# Altium schematic sheet receiver.SchDoc
size OrCAD C; SheetNumber: 1; SheetTotal: 2
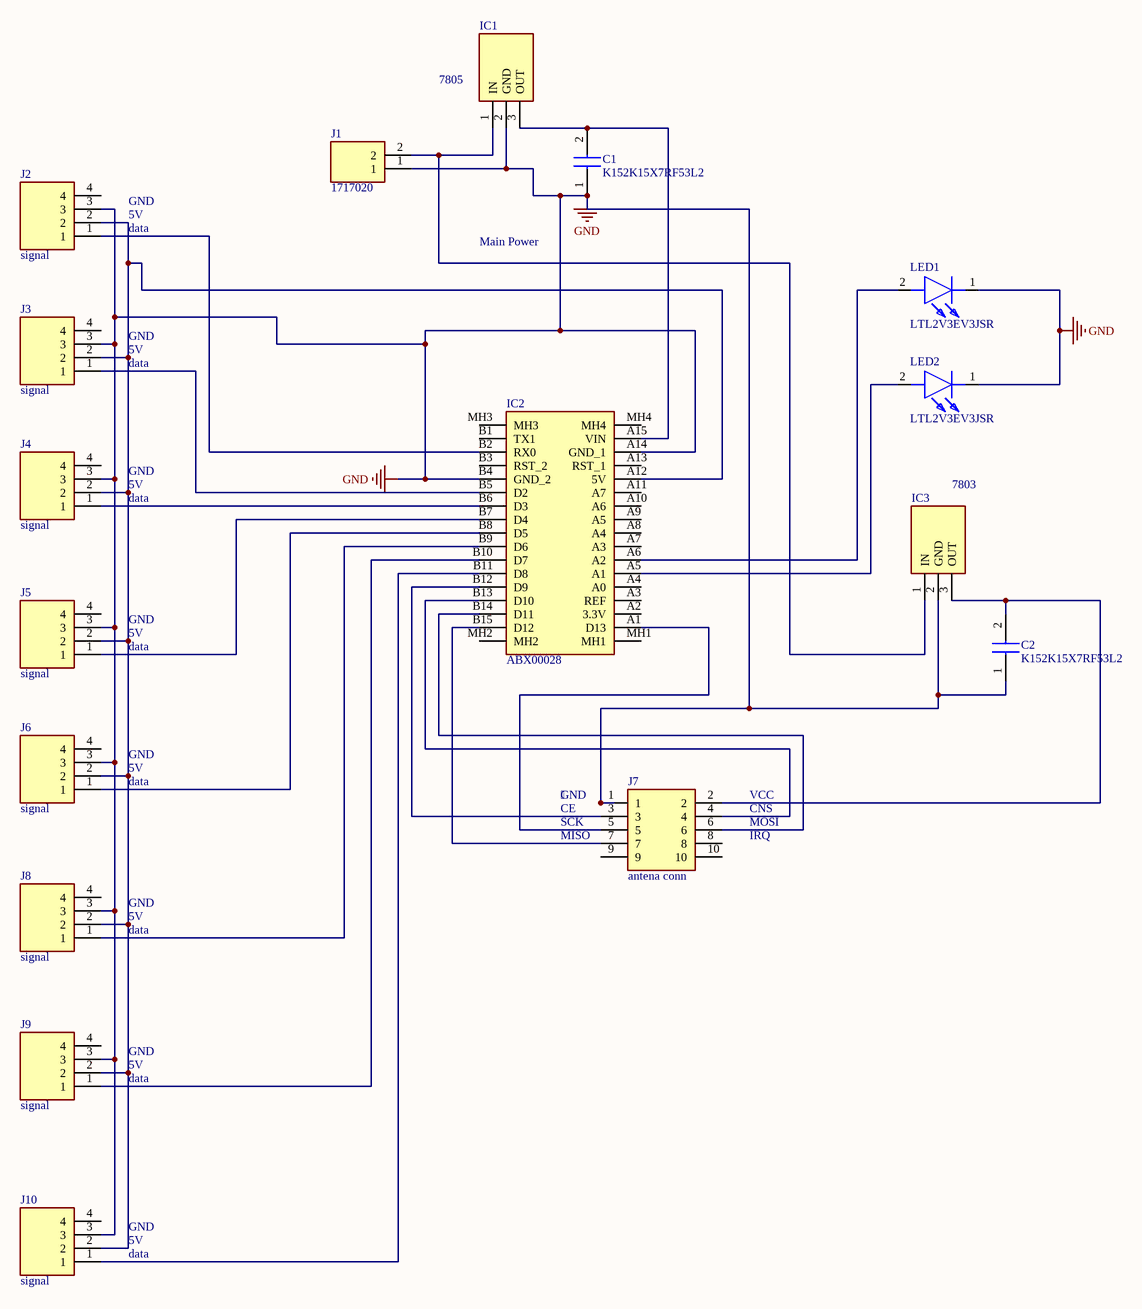
[diagram p0: receiver.SchDoc]

## Parts
C1  K152K15X7RF53L2  [K152K15X7RF53L2]
C2  K152K15X7RF53L2  [K152K15X7RF53L2]
IC1  7805  [TO254P470X1000X1610-3P]
IC2  ABX00028  [ABX00028]
IC3  7803  [TO254P470X1000X1610-3P]
J1  1717020  [1717020]
J2  signal  [HDRV4W87P0X254_1X4_991X236X1155P]
J3  signal  [HDRV4W87P0X254_1X4_991X236X1155P]
J4  signal  [HDRV4W87P0X254_1X4_991X236X1155P]
J5  signal  [HDRV4W87P0X254_1X4_991X236X1155P]
J6  signal  [HDRV4W87P0X254_1X4_991X236X1155P]
J7  antena conn  [HDRV10W87P254_2X5_1270X508X864P]
J8  signal  [HDRV4W87P0X254_1X4_991X236X1155P]
J9  signal  [HDRV4W87P0X254_1X4_991X236X1155P]
J10  signal  [HDRV4W87P0X254_1X4_991X236X1155P]
LED1  LTL2V3EV3JSR  [LTL2V3EV3JSR]
LED2  LTL2V3EV3JSR  [LTL2V3EV3JSR]

## Nets
GND: C1.1 C2.1 IC1.2(GND) IC2.A14(GND_1) IC2.B4(GND_2) IC3.2(GND) J1.1 J2.3 J3.3 J4.3 J5.3 J6.3 J7.1 J8.3 J9.3 J10.3 LED1.1(K) LED2.1(K)
NetC1_2: C1.2 IC1.3(OUT) IC2.A15(VIN)
NetC2_2: C2.2 IC3.3(OUT) J7.2
NetIC1_1: IC1.1(IN) IC3.1(IN) J1.2
NetIC2_A1: IC2.A1(D13) J7.5
NetIC2_A5: IC2.A5(A1) LED2.2(A)
NetIC2_A6: IC2.A6(A2) LED1.2(A)
NetIC2_A12: IC2.A12(5V) J2.2 J3.2 J4.2 J5.2 J6.2 J8.2 J9.2 J10.2
NetIC2_B2: IC2.B2(RX0) J2.1
NetIC2_B5: IC2.B5(D2) J3.1
NetIC2_B6: IC2.B6(D3) J4.1
NetIC2_B7: IC2.B7(D4) J5.1
NetIC2_B8: IC2.B8(D5) J6.1
NetIC2_B9: IC2.B9(D6) J8.1
NetIC2_B10: IC2.B10(D7) J9.1
NetIC2_B11: IC2.B11(D8) J10.1
NetIC2_B12: IC2.B12(D9) J7.3
NetIC2_B13: IC2.B13(D10) J7.4
NetIC2_B14: IC2.B14(D11) J7.6
NetIC2_B15: IC2.B15(D12) J7.7

Not connected (* = marked no-connect by the designer): IC2 A2(3.3V) A3(REF) A4(A0) A7(A3) A8(A4) A9(A5) A10(A6) A11(A7) A13(RST_1) B1(TX1) B3(RST_2) MH1 MH2 MH3 MH4; J2 4; J3 4; J4 4; J5 4; J6 4; J7 8 9 10; J8 4; J9 4; J10 4

## Notes on the sheet
- GND
- 5V
- data
- Main Power
- 
- CE
- (near J7) SCK
- (near J7) MISO
- (near J7) GND
- VCC
- CNS
- MOSI
- IRQ

## Library data of the parts
C1 C2 = K152K15X7RF53L2: Capacitor; Manufacturer_Name: Vishay; Datasheet Link: https://www.vishay.com/doc?45171; Height: 5.6mm; Manufacturer_Part_Number: K152K15X7RF53L2; Mouser Part Number: 594-K152K15RF53L2; Mouser Price/Stock: https://www.mouser.com/Search/Refine.aspx?Keyword=594-K152K15RF53L2
IC1 IC3 = 7805: Integrated Circuit; Manufacturer_Name: Foshan Blue Rocket Elec; Datasheet Link: https://datasheet.lcsc.com/szlcsc/1812061730_BLUE-ROCKET-7805_C305416.pdf; Height: 4.7mm; Manufacturer_Part_Number: 7805
IC2 = ABX00028: Integrated Circuit; Manufacturer_Name: Arduino; Datasheet Link: https://store.arduino.cc/arduino-nano-every; Height: 10mm; Manufacturer_Part_Number: ABX00028; Mouser Part Number: 782-ABX00028; Mouser Price/Stock: https://www.mouser.co.uk/ProductDetail/Arduino/ABX00028?qs=PzGy0jfpSMtit6rnFl8mVg%3D%3D; Arrow Part Number: ABX00028; Arrow Price/Stock: https://www.arrow.com/en/products/abx00028/arduino-corporation?region=nac
J1 = 1717020: Connector; Manufacturer_Name: Phoenix Contact; Datasheet Link: https://www.phoenixcontact.com/en-us/products/printed-circuit-board-terminal-gmkds-15-2-1717020; Manufacturer_Part_Number: 1717020; Mouser Part Number: 651-1717020; Mouser Price/Stock: https://www.mouser.co.uk/ProductDetail/Phoenix-Contact/1717020?qs=aYsvlkyO7qPz8sNM1KmjVQ%3D%3D; Arrow Part Number: 1717020; Arrow Price/Stock: https://www.arrow.com/en/products/1717020/phoenix-contact
J2-J6 J8-J10 = 0022032041: Connector; Manufacturer_Name: Molex; Datasheet Link: http://www.molex.com/pdm_docs/sd/022032041_sd.pdf; Height: 11.55mm; Manufacturer_Part_Number: 0022032041; Mouser Part Number: N/A; Mouser Price/Stock: https://www.mouser.co.uk/ProductDetail/Molex/0022032041?qs=PBcRNPEHKsrt5pJfEqGMHQ%3D%3D; Arrow Part Number: 0022032041; Arrow Price/Stock: https://www.arrow.com/en/products/0022032041/molex
J7 = 0010897100: Connector; Manufacturer_Name: Molex; Datasheet Link: http://www.molex.com/pdm_docs/sd/010897100_sd.pdf; Height: 8.64mm; Manufacturer_Part_Number: 0010897100; Mouser Part Number: N/A; Mouser Price/Stock: https://www.mouser.co.uk/ProductDetail/Molex/0010897100?qs=PBcRNPEHKsqIDCZzUxhahw%3D%3D; Arrow Part Number: 0010897100; Arrow Price/Stock: https://www.arrow.com/en/products/0010897100/molex?region=nac
LED1 LED2 = LTL2V3EV3JSR: LED; Manufacturer_Name: Lite-On; Datasheet Link: https://componentsearchengine.com/Datasheets/1/LTL2V3EV3JSR.pdf; Height: 12.7mm; Manufacturer_Part_Number: LTL2V3EV3JSR; Mouser Part Number: 859-LTL2V3EV3JSR; Mouser Price/Stock: https://www.mouser.co.uk/ProductDetail/Lite-On/LTL2V3EV3JSR?qs=plZGoh4IuyGDOWbhxHlEvg%3D%3D; Arrow Part Number: LTL2V3EV3JSR; Arrow Price/Stock: https://www.arrow.com/en/products/ltl2v3ev3jsr/lite-on-technology